# Altium schematic sheet Capstone PCB.SchDoc: NER A Size Template
size Tabloid; ApprovedBy: WS; DrawnBy: Cameron Gordon & Elise Cooke; Address4: X.X.X; Revision: 1; SheetNumber: 1; SheetTotal: 2
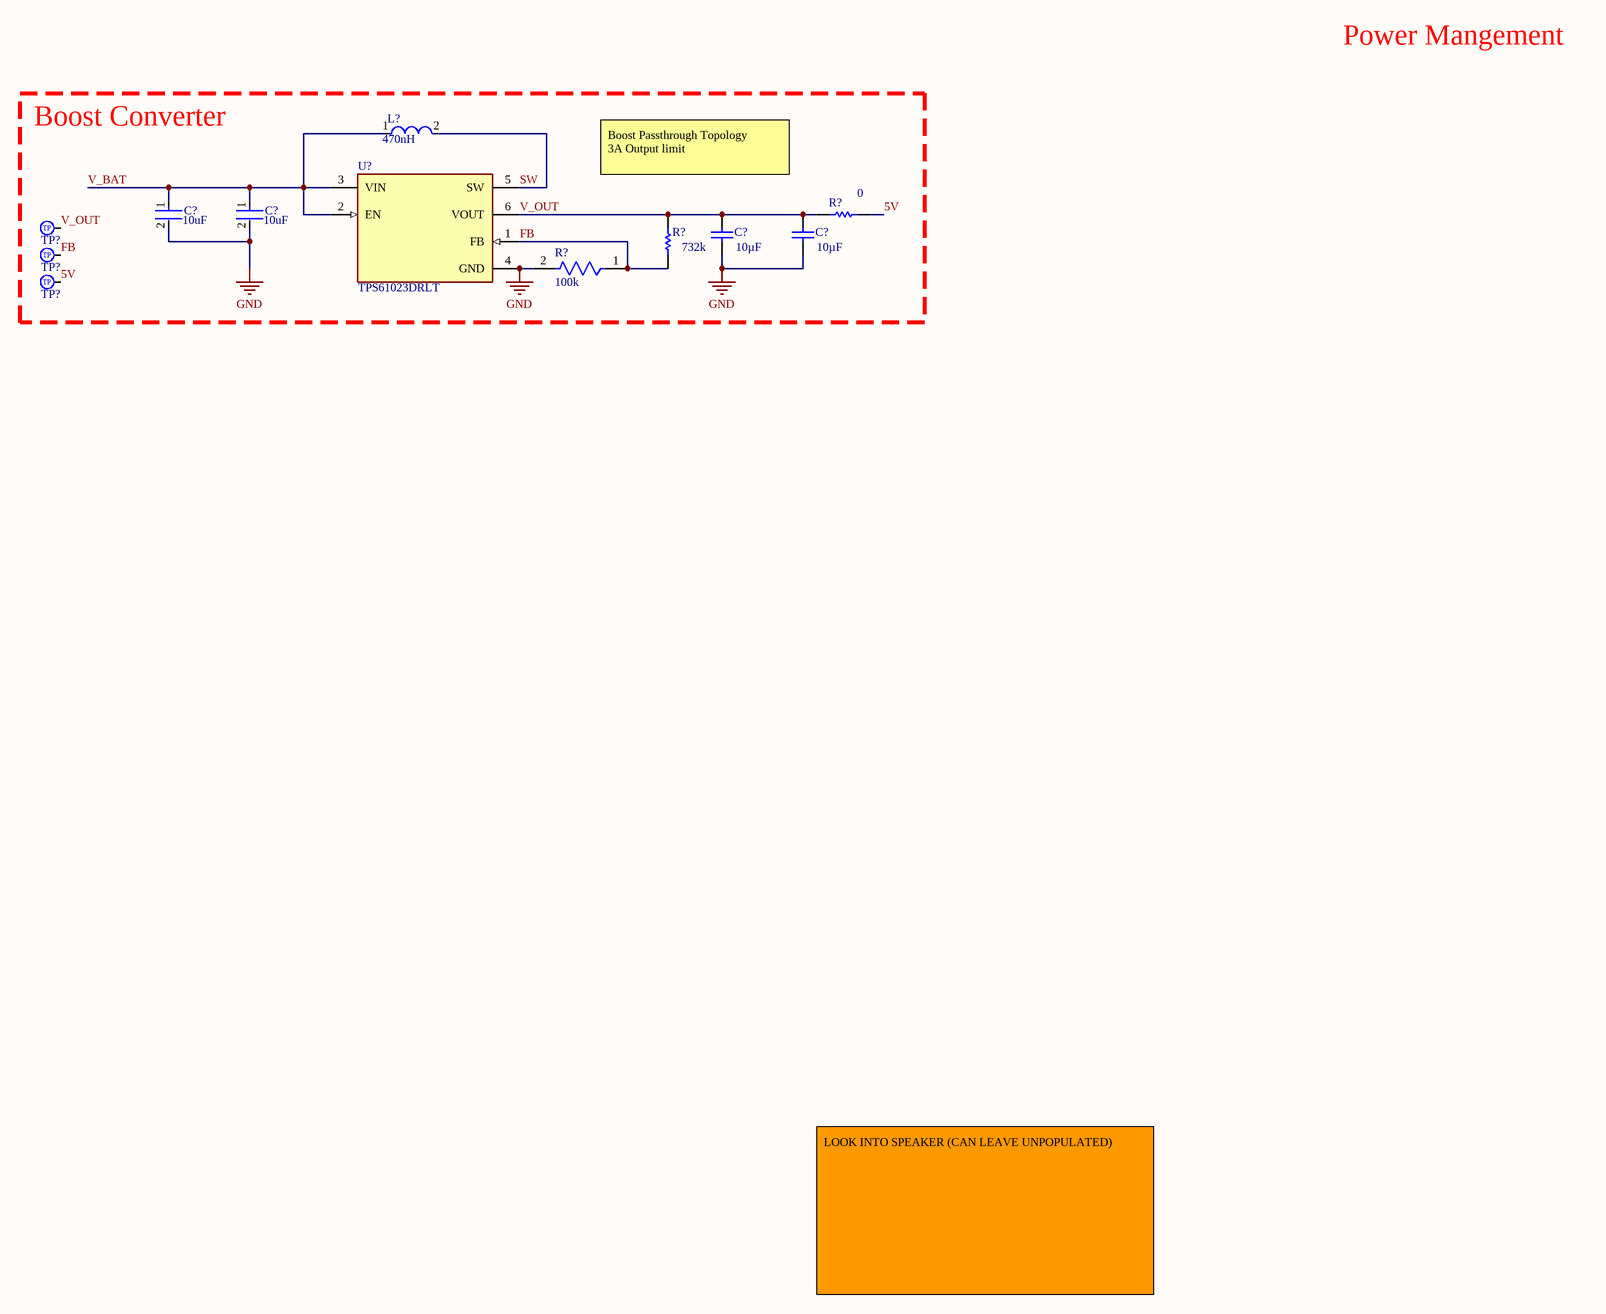
[diagram p0: Capstone PCB.SchDoc]

## Parts
(Parts that share a designator on the sheet are numbered #1, #2 ... from top to bottom, then left to right.)
C?#1  value 10uF  [FP-C0805C-DG-MFG]  (hidden comment: C0805C106K8PACTU)
C?#2  value 10uF  [FP-C0805C-DG-MFG]  (hidden comment: C0805C106K8PACTU)
C?#3  Capacitance: 10µF  [CAPC3216X180X55LL20T25]  (hidden comment: GRM31CR71C106KAC7L)
C?#4  Capacitance: 10µF  [CAPC3216X180X55LL20T25]  (hidden comment: GRM31CR71C106KAC7L)
L?  Inductance: 470nH  [FP-IHLP-1212AE-11-MFG]  (hidden comment: IHLP1212AEERR47M11)
R?#1  Resistance: 0  [RESC2013X60X35ML10T20]  (hidden comment: RC0805JR-070RL)
R?#2  value 732k  [RESC2013X60X35ML10T20]  (hidden comment: RC0805FR-07732KL)
R?#3  Resistance: 100k  [FP-RC0805-0_6-MFG]  (hidden comment: RC0805JR-07100KL)
TP?#1  0.040" Circular Test Point  [40 mil Circular Test Point]  (value not drawn)
TP?#2  0.040" Circular Test Point  [40 mil Circular Test Point]  (value not drawn)
TP?#3  0.040" Circular Test Point  [40 mil Circular Test Point]  (value not drawn)
U?  TPS61023DRLT  [FP-DRL0006A-MFG]

## Blocks framed on the sheet
Boost Converter: C?#1-C?#4 L? R?#1-R?#3 TP?#1-TP?#3 U?

## Nets
GND: C?#1.2 C?#2.2 C?#3.1 C?#4.1 R?#3.2 U?.4(GND)
5V: R?#1.2 TP?#3.1
FB: R?#2.1 R?#3.1 TP?#2.1 U?.1(FB)
SW: L?.2 U?.5(SW)
V_BAT: C?#1.1 C?#2.1 L?.1 U?.2(EN) U?.3(VIN)
V_OUT: C?#3.2 C?#4.2 R?#1.1 R?#2.2 TP?#1.1 U?.6(VOUT)

## Notes on the sheet
- Power Mangement
- Boost Passthrough Topology
  3A Output limit
- LOOK INTO SPEAKER (CAN LEAVE UNPOPULATED)
- Project Name:
- Drawer:
- Variant:
- Revision:
- Date:
- Page:
- of
- Capstone 2023
- (in symbol CMP-00017-2) TP

## Library data of the parts
C?#1 C?#2 = CMP-2007-03243-2: CAP CER 10UF 10V X5R 0805; Manufacturer: Kemet; 3DS Part Number: 220-00001; Tolerance: 10%; Description: SMD Comm X5R, Ceramic, 10 uF, 10%, 10 V, X5R, SMD, MLCC, Temperature Stable, Class II, 0805; Temperature Coefficient: 15%; Material: Ceramic; Device Class L2: Capacitors; Device Class L1: Passive Components; ComponentLink2URL: https://content.kemet.com/datasheets/KEM_C1006_X5R_SMD.pdf; Height: 1.4mm; Lead Free: Yes; Manufacturer Part Number: C0805C106K8PACTU; Digikey Description: CAP CER 10UF 10V X5R 0805; Octopart: https://octopart.com/c0805c106k8pactu-kemet-98697; Capacitance: 10uF; Temperature Range Low: -55°C; Temperature: -55°C to +85°C; Automotive: No; Mouser Description: CAP CER 10UF 10V X5R 0805; Ipc Land Pattern Name: CAPC200125X125; Temperature Range High: +85°C; Voltage: 10V; RoHS: TRUE; Device Class L3: Ceramic Capacitors; ComponentLink2Description: Datasheet; Voltage Rating: 10V; Package: C0805C-DG; Temperature Characteristic: X5R; Category: Cap
C?#3 C?#4 = CMP-2000-06352-1: Chip Capacitor, 10 uF, +/- 10%, 16 V, -55 to 125 degC, 1206 (3216 Metric), RoHS, Tape and Reel; Manufacturer: Murata; Other Names: 490-3911-6; Product Training Modules: High-CapMultilayerCeramicCapacitors; Temperature Coefficient: X7R; Catalog Drawings: GRMSeries_1206_1.6; Featured Product: GA3SafetyRecognizedCapsandHi-CapMLCC; Online Catalog: GRMSeries; Voltage - Rated: 16V; Size / Dimension: 0.126"Lx0.063"W(3.20mmx1.60mm); Applications: GeneralPurpose; Package Description: 2-Pin Surface Mount Device, Body 3.2 x 1.6 mm; Datasheet Version: 03/2016; Package Reference: 1206; Manufacturer URL: http://www.murata.com/; Standard Package: 1; Mounting Type: SurfaceMount,MLCC; Thickness (Max): 0.071"(1.80mm); Category: Capacitors; Family: CeramicCapacitors; Lead Spacing: -; Tolerance: ±10%; Packaging: Digi-Reel®; Lead Style: -; Package / Case: 1206(3216Metric); Datasheet URL: http://search.murata.co.jp/Ceramy/image/img/A01X/G101/ENG/GRM31CR71C106KAC7-01.pdf; Operating Temperature: -55°C~125°C; Mounting Technology: SurfaceMount; Series: GRM; Ratings: -; Height - Seated (Max): -; Features: -
L? = CMP-02424-000856-1: FIXED IND 470NH 6.7A 15 MOHM SMD; Shielding: Shielded; DC Resistance (DCR): 15mR; Test Frequency: 100kHz; Self Resonant Frequency: 1MHz; Core Material: Ferrite; Tolerance: 20%; Depth: 3.2mm; Case/Package: Nonstandard; Packaging: Cut Tape; Number of Pins: 2; Case Code (Imperial): 1212; Height - Seated (Max): 0.059inch; RoHS Compliant: Yes; Height: 1.2mm; Military Standard: Not; Lead Free: Lead Free; Width: 0.118inch; Saturation Current: 6.7A; Radiation Hardening: No; Mount: Surface Mount; Series: IHLP-1212AE-11; Max DC Current: 6.7A; Termination: SMD/SMT; Current Rating: 6.7A; Rated Current-Max: 6.7A; RMS Current (Irms): 6.7A; Inductance Tolerance: 20%; Package Quantity: 3000; Max Operating Temperature: 125°C; Length: 0.144inch; Min Operating Temperature: -55°C
R?#1 = CMP-2100-03673-1: Chip Resistor, 0 Ohm, Jumper, +/- 5%, 0.125 W, -55 to 155 degC, 0805 (2012 Metric), RoHS, Tape and Reel; Manufacturer: Yageo; Power Rating: 125mW; Voltage Rating (DC): 150V; Temperature Coefficient: 200ppm/degreesC; Height: 0.5mm; Depth: 1.25mm; Case Code (Imperial): 0805; Lead Free: LeadFree; Military Standard: Not; Package Description: 2-Pin Surface Mounted Device, Body 2 x 1.25 mm; Case Code (Metric): 2012; Composition: ThickFilm; Voltage Rating: 150V; Manufacturer URL: http://www.yageo.com/; Packaging: TapeandReel; Package Reference: 0805; REACH SVHC: Unknown; Tolerance: 5%; Case/Package: 0805; Max Operating Temperature: 155degC; Number of Pins: 2; Min Operating Temperature: -55degC; RoHSCompliant: true; Length: 2mm; Datasheet URL: http://www.yageo.com/NewPortal/yageodocoutput?fileName=/pdf/R-Chip/PYu-RC_Group_51_RoHS_L_5.pdf; Termination: SMD/SMT; Radiation Hardening: No; Width: 1.25mm; Contact Plating: Tin; Datasheet Version: Rev. 5, 10/2016
R?#2 = CMP-2001-01259-1: Manufacturer: Yageo; Part Number: RC0805FR-07732KL
R?#3 = CMP-03412-037835-1: RES SMD 100K OHM 5% 1/8W 0805; Voltage Rating: 150V; Power Rating: 125mW; Temperature Coefficient: 100ppm/°C; Radiation Hardening: No; Lead Free: Lead Free; Size Code: 0805; Resistance Tolerance: 5%; Case Code (Imperial): 0805; Min Operating Temperature: -55°C; Packaging: Tape and Reel; Termination: SMD/SMT; Number of Terminations: 2; RoHS Compliant: Yes; Features: Moisture Resistant; Construction: Rectangular; Series: RC; Max Operating Temperature: 155°C; Military Standard: Not; Depth: 1.25mm; Contact Plating: Tin; Tolerance: 5%; Max Power Dissipation: 125mW; Length: 2mm; Case Code (Metric): 2012; Resistor Type: Thick Film; Case/Package: 0805
TP?#1-TP?#3 = CMP-00017-2
U? = CMP-04918-000657-1: IC REG BOOST ADJ 3A SOT563